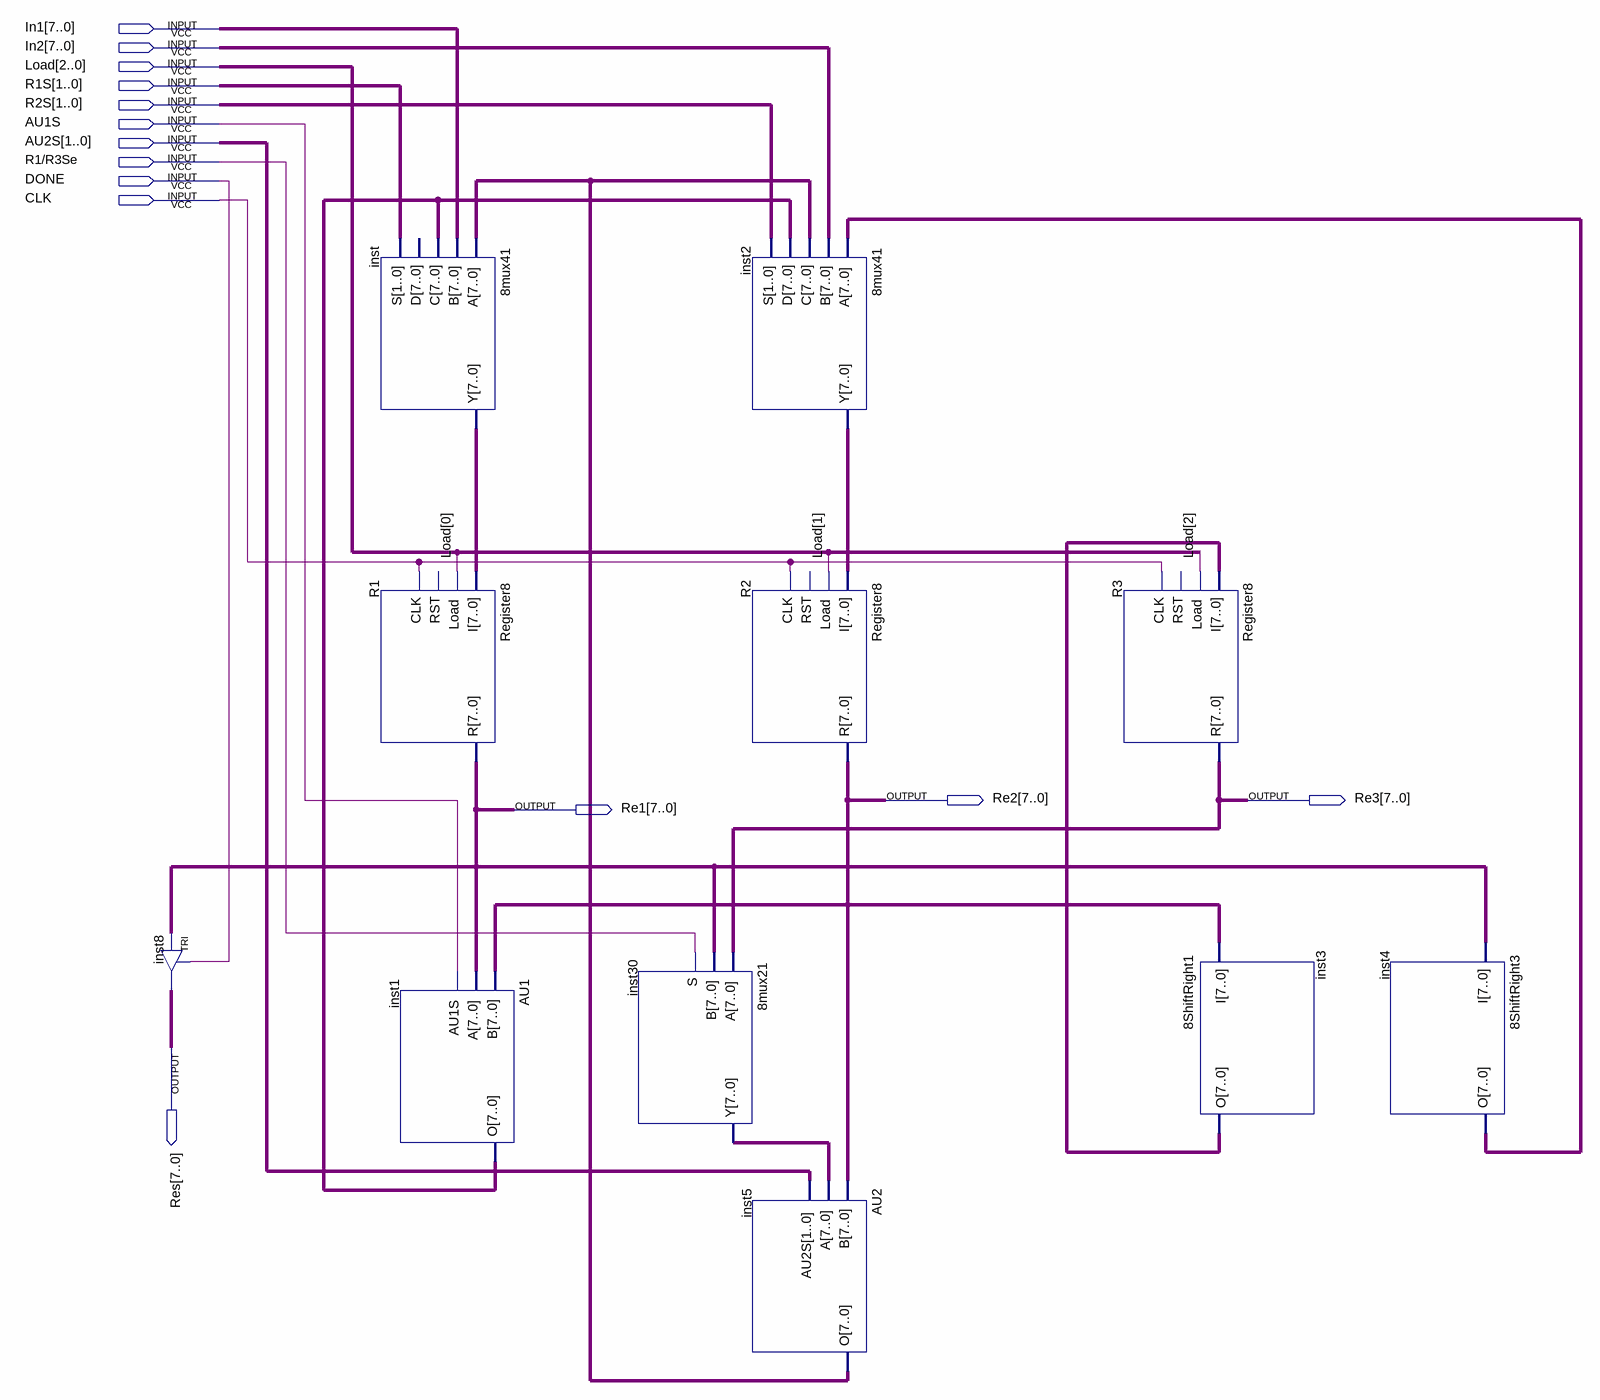
[diagram p0: schematic sheet]
// Quartus schematic DtpOM.bdf as structural Verilog: 11 symbols, 14 pins
module DtpOM (
  input  [7:0] In1,
  input  [7:0] In2,
  input  [2:0] Load,
  input  [1:0] R1S,
  input  [1:0] R2S,
  input  AU1S,
  input  [1:0] AU2S,
  input  \R1/R3Se ,
  input  DONE,
  input  CLK,
  output [7:0] Re2,
  output [7:0] Re3,
  output [7:0] Re1,
  output [7:0] Res
);

  wire [7:0] inst1_o, inst2_y, inst3_o, inst4_o, inst5_o, inst30_y, inst_y;

  TRI inst8[7:0] (.IN(Re1), .OE(DONE), .OUT(Res));
  \8mux41  inst (.A(inst5_o), .B(In1), .C(inst1_o), .S(R1S), .Y(inst_y));  // open: D
  Register8 R1 (.I(inst_y), .Load(Load[0]), .CLK(CLK), .R(Re1));  // open: RST
  AU1 inst1 (.B(Re2), .A(Re1), .AU1S(AU1S), .O(inst1_o));
  \8mux21  inst30 (.A(Re3), .B(Re1), .S(\R1/R3Se ), .Y(inst30_y));
  \8mux41  inst2 (.A(inst4_o), .B(In2), .C(inst5_o), .D(inst1_o), .S(R2S), .Y(inst2_y));
  Register8 R2 (.I(inst2_y), .Load(Load[1]), .CLK(CLK), .R(Re2));  // open: RST
  AU2 inst5 (.A(inst30_y), .B(Re2), .AU2S(AU2S), .O(inst5_o));
  Register8 R3 (.I(inst3_o), .Load(Load[2]), .CLK(CLK), .R(Re3));  // open: RST
  \8ShiftRight1  inst3 (.I(Re2), .O(inst3_o));
  \8ShiftRight3  inst4 (.I(Re1), .O(inst4_o));
endmodule
